# EAGLE schematic ManitoBoardv.5 (EAGLE 7.2.0)
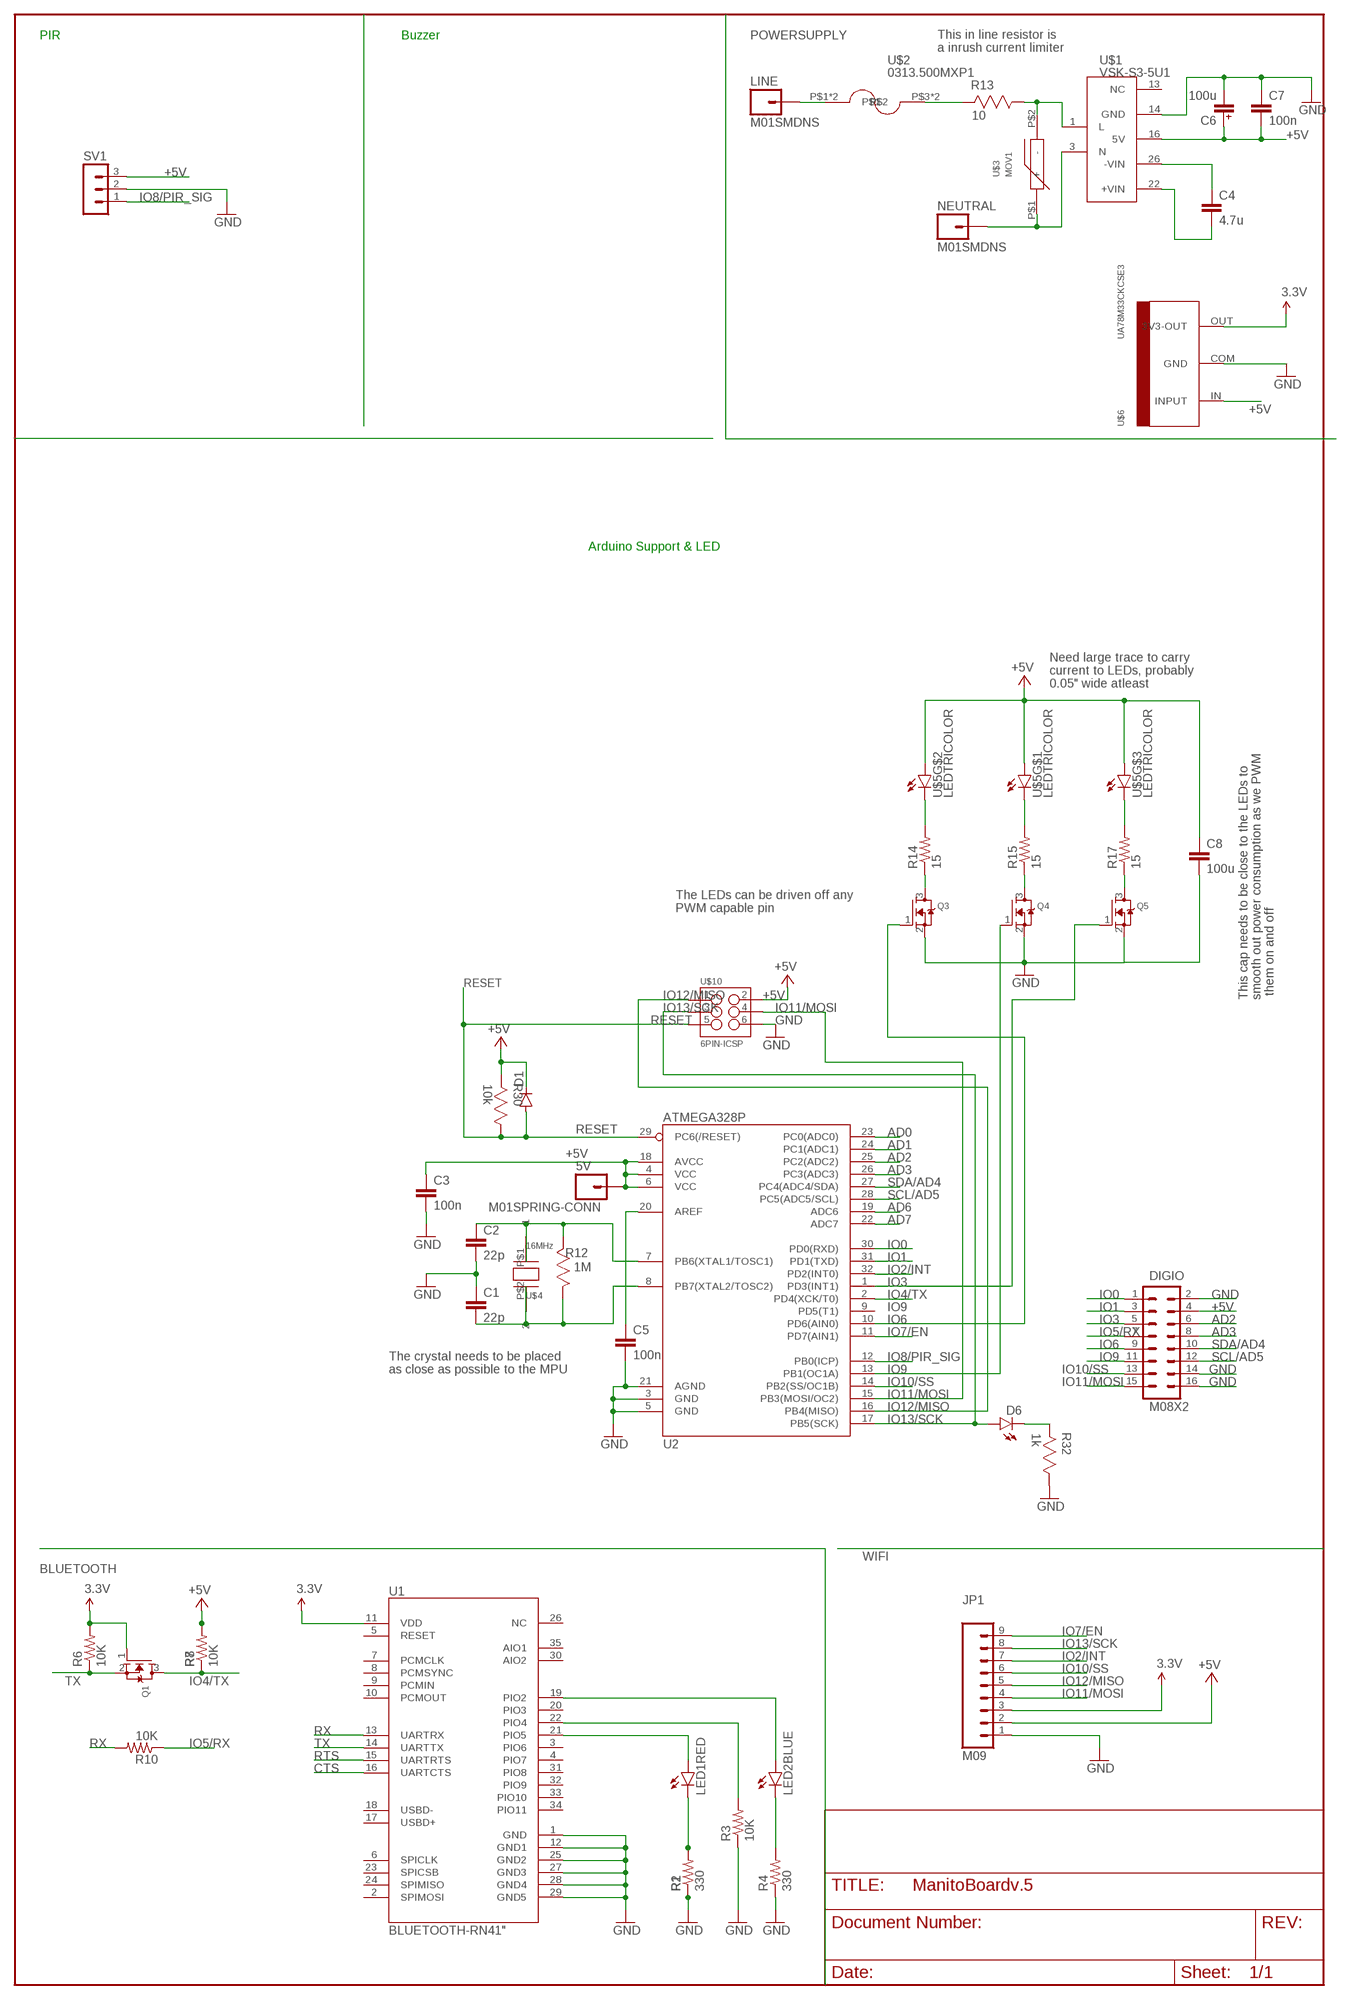
[diagram p0: schematic, sheet 1]

## Parts
5V  M01SPRING-CONN  [SPRING-CONNECTOR]
C1  22p  CAP0603-CAP  [0603-CAP]
C2  22p  CAP0603-CAP  [0603-CAP]
C3  100n  CAP0603-CAP  [0603-CAP]
C4  4.7u  CAP0603-CAP  [0603-CAP]
C5  100n  CAP0603-CAP  [0603-CAP]
C6  100u  SMDCAP1  [WXSERIES-SMDCAP]
C7  100n  CAP0603-CAP  [0603-CAP]
C8  100u  CAP0603-CAP  [0603-CAP]
D1  DIODE1N4148  [DIODE-1N4148]
D6  LED-YELLOW0603  [LED-0603]
DIGIO  M08X2  [2X8]
JP1  M09  [1X09]
LED1RED  LED3MM  [LED3MM]
LED2BLUE  LED3MM  [LED3MM]
LINE  M01SMDNS  [1X01NS]
NEUTRAL  M01SMDNS  [1X01NS]
Q1  MOSFET-NREFLOW  [SOT23]
Q3  MOSFET-NREFLOW  [SOT23]
Q4  MOSFET-NREFLOW  [SOT23]
Q5  MOSFET-NREFLOW  [SOT23]
R1  RESISTORPTH-1/4W  [AXIAL-0.4]
R2  330  RESISTORPTH-1/4W  [AXIAL-0.4]
R3  10K  RESISTORPTH-1/4W  [AXIAL-0.4]
R4  330  RESISTORPTH-1/4W  [AXIAL-0.4]
R6  10K  RESISTORPTH-1/2W  [AXIAL-0.5]
R7  RESISTORPTH-1/2W  [AXIAL-0.5]
R8  10K  RESISTORPTH-1/2W  [AXIAL-0.5]
R10  10K  RESISTORPTH-1/2W  [AXIAL-0.5]
R12  1M  0603RESISTOR1  [0603RESISTOR]
R13  10  0603RESISTOR1  [0603RESISTOR]
R14  15  RESISTORPTH-1W  [AXIAL-0.6]
R15  15  RESISTORPTH-1W  [AXIAL-0.6]
R17  15  RESISTORPTH-1W  [AXIAL-0.6]
R30  10k  0603RESISTOR1  [0603RESISTOR]
R32  1k  0603RESISTOR1  [0603RESISTOR]
SV1  MA03-1  [MA03-1]
U1  BLUETOOTH-RN41"  [RN41]
U2  ATMEGA328P  ATMEGA328_SMT  [TQFP32-08]
U$1  VSK-S3-5U1  [VSK-S3-DCAC]
U$2  0313.500MXP1  [FUSEHOLDER0.25IN]
U$3  MOV1  [MOV]
U$4  16MHz  SMDCRYSTAL  [SMDCRYSTAL]
U$5  LEDTRICOLOR  [TRICOLORLED]
U$6  UA78M33CKCSE3  [TO220]
U$10  6PIN-ICSP  [2X3-ICSP]

## Nets
+5V [usbvcc]: 5V.P$2 C3.1 C6.POS C7.2 C8.1 D1.C DIGIO.4 JP1.2 R7.P$2 R8.P$2 R30.2 SV1.3 U2.4(VCC) U2.6(VCC) U2.18(AVCC) U$1.16(5V) U$5.A1(A) U$5.A2(A) U$5.A3(A) U$6.IN(INPUT) U$10.2(+5V)
AD0: U2.23(PC0(ADC0))
AD1: U2.24(PC1(ADC1))
AD2: DIGIO.6 U2.25(PC2(ADC2))
AD3: DIGIO.8 U2.26(PC3(ADC3))
AD6: U2.19(ADC6)
AD7: U2.22(ADC7)
CTS: U1.16(UARTCTS)
GND: C1.1 C2.2 C3.2 C5.2 C6.NEG C7.1 C8.2 DIGIO.2 DIGIO.14 DIGIO.16 JP1.1 Q3.2(S) Q4.2(S) Q5.2(S) R1.P$1 R2.P$1 R3.P$1 R4.P$1 R32.1 SV1.2 U1.1(GND) U1.12(GND1) U1.25(GND2) U1.27(GND3) U1.28(GND4) U1.29(GND5) U2.3(GND) U2.5(GND) U2.21(AGND) U$1.14(GND) U$6.COM(GND) U$10.6(GND)
IO0: DIGIO.1 U2.30(PD0(RXD))
IO1: DIGIO.3 U2.31(PD1(TXD))
IO2/INT: JP1.7 U2.32(PD2(INT0))
IO3: DIGIO.5 Q5.1(G) U2.1(PD3(INT1))
IO4/TX: Q1.3(D) R7.P$1 R8.P$1 U2.2(PD4(XCK/T0))
IO5/RX: DIGIO.7 R10.P$1
IO6: DIGIO.9 Q3.1(G) U2.10(PD6(AIN0))
IO7/EN: JP1.9 U2.11(PD7(AIN1))
IO8/PIR_SIG: SV1.1 U2.12(PB0(ICP))
IO9: DIGIO.11 Q4.1(G) U2.13(PB1(OC1A))
IO10/SS: DIGIO.13 JP1.6 U2.14(PB2(SS/OC1B))
IO11/MOSI: DIGIO.15 JP1.4 U2.15(PB3(MOSI/OC2)) U$10.4(MOSI)
IO12/MISO: JP1.5 U2.16(PB4(MISO)) U$10.1(MISO)
IO13/SCK: D6.A JP1.8 U2.17(PB5(SCK)) U$10.3(SCK)
N$1: C1.2 R12.1 U2.8(PB7(XTAL2/TOSC2)) U$4.P$2
N$3: LED1RED.K(C) R1.P$2 R2.P$2
N$4: C2.1 R12.2 U2.7(PB6(XTAL1/TOSC1)) U$4.P$1
N$6: Q5.3(D) R17.P$1
N$7: Q4.3(D) R15.P$1
N$8: Q3.3(D) R14.P$1
N$17: C5.1 U2.20(AREF)
N$18: D6.C R32.2
N$19: C4.1 U$1.26(-VIN)
N$20: LED2BLUE.K(C) R4.P$2
N$21: C4.2 U$1.22(+VIN)
N$22: R13.1 U$1.1(L) U$3.P$2(-)
N$23: NEUTRAL.1 U$1.3(N) U$3.P$1(+)
N$24: LINE.1 U$2.P$1 U$2.P$2
N$25: R13.2 U$2.P$3 U$2.P$4
N$29: R14.P$2 U$5.C2(C)
N$30: R15.P$2 U$5.C1(C)
N$31: R17.P$2 U$5.C3(C)
N$32: LED1RED.A U1.21(PIO5)
N$33: R3.P$2 U1.22(PIO4)
N$34: LED2BLUE.A U1.19(PIO2)
RESET: D1.A R30.1 U2.29(PC6(/RESET)) U$10.5(RESET)
RTS: U1.15(UARTRTS)
RX: R10.P$2 U1.13(UARTRX)
SCL/AD5: DIGIO.12 U2.28(PC5(ADC5/SCL))
SDA/AD4: DIGIO.10 U2.27(PC4(ADC4/SDA))
TX: Q1.2(S) R6.P$1 U1.14(UARTTX)
VCC: JP1.3 Q1.1(G) R6.P$2 U1.11(VDD) U$6.OUT(3V3-OUT) ; supply symbol labelled 3.3V
Unconnected: U1.2(SPIMOSI) U1.3(PIO6) U1.4(PIO7) U1.5(RESET) U1.6(SPICLK) U1.7(PCMCLK) U1.8(PCMSYNC) U1.9(PCMIN) U1.10(PCMOUT) U1.17(USBD+) U1.18(USBD-) U1.20(PIO3) U1.23(SPICSB) U1.24(SPIMISO) U1.26(NC) U1.30(AIO2) U1.31(PIO8) U1.32(PIO9) U1.33(PIO10) U1.34(PIO11) U1.35(AIO1) U2.9(PD5(T1)) U$1.13(NC)

## Notes on the sheet
- PIR | Buzzer
- This in line resistor is 
  a inrush current limiter
- Arduino Support & LED
- Need large trace to carry
  current to LEDs, probably
  0.05" wide atleast
- The LEDs can be driven off any
  PWM capable pin
- This cap needs to be close to the LEDs to 
  smooth out power consumption as we PWM
   them on and off
- The crystal needs to be placed
  as close as possible to the MPU

## Library data of the parts
5V LINE NEUTRAL = CharlieCreations:M01: Header 1 Standard 1-pin 0.1" header. Use with straight break away headers (SKU : PRT-00116), right angle break away headers (PRT-00553), swiss pins (PRT-00743), machine pins (PRT-00117), and female headers (PRT-00115).
C1-C5 C7 C8 = CharlieCreations:CAP: Capacitor Standard 0603 ceramic capacitor, and 0.1" leaded capacitor.
C6 = CharlieCreations:SMDCAP
D1 = CharlieCreations:DIODE: Diode These are standard reverse protection diodes and small signal diodes. SMA package can handle up to about 1A. SOD-323 can handle about 200mA. What the SOD-323 package when ordering, there are some mfgs out there that are 5-pin packages.
D6 = CharlieCreations:LED-YELLOW: Yellow SMD LEDs LilyPad 1206- DIO-09909 0603- DIO-09003; PROD_ID: DIO-09003
DIGIO = CharlieCreations:M08X2: .1" headers, two rows of 8 each
JP1 = SparkFun-Connectors:M09: Header 9 Standard 9-pin 0.1" header. Use with straight break away headers (SKU : PRT-00116), right angle break away headers (PRT-00553), swiss pins (PRT-00743), machine pins (PRT-00117), and female headers (PRT-00115).
LED1RED LED2BLUE = SparkFun-LED:LED: LEDs Standard schematic elements and footprints for 5mm, 3mm, 1206, and 0603 sized LEDs. 5mm - Spark Fun Electronics SKU : COM-00529 (and others)
Q1 = adafruit:MOSFET-N: N-Channel Mosfet 2N7002E - 60V 260mA SOT23 [Digikey: 2N7002ET1GOSTR-ND] - REEL BSH103 - 30V 850mA SOT23 [Digikey: 568-5013-1-ND]
Q3-Q5 = CharlieCreations:MOSFET-N: N-Channel Mosfet 2N7002E - 60V 260mA SOT23 [Digikey: 2N7002ET1GOSTR-ND] - REEL BSH103 - 30V 850mA SOT23 [Digikey: 568-5013-1-ND]
R1-R4 R6-R8 R10 R14 R15 R17 = SparkFun-Passives:RESISTOR: Resistor Basic schematic elements and footprints for 0603, 1206, and PTH resistors.
R12 R13 R30 R32 = CharlieCreations:0603RESISTOR: RESISTOR, 0603; MPN: CRCW06031K21FKEA; OC_FARNELL: 1652852; OC_NEWARK: 52K8027; SUPPLIER: Vishay; TOLERANCE: ± 1.0 %; VALUE: 0; WATTAGE: 0.1W
SV1 = con-lstb:MA03-1: PIN HEADER; OC_FARNELL: unknown; OC_NEWARK: unknown
U1 = SparkFun:BLUETOOTH-RN41
U2 = CharlieCreations:ATMEGA328_SMT: 32-Pin Atmega328 part Commonly used on Arduino compatible boards Available in QFP and QFN packages TQFP is IC-09069 QFN is non-stock; PROD_ID: IC-09069
U$1 = CharlieCreations:VSK-S3-5U: Universal AC to DC adapter, 5V Output, Manufacturer: CUI Inc
U$2 = CharlieCreations:0313.500MXP: 500mA Fuse by LittleFuse INC
U$3 = CharlieCreations:MOV
U$4 = CharlieCreations:SMDCRYSTAL
U$5 = CharlieCreations:LEDTRICOLOR
U$6 = CharlieCreations:UA78M33CKCSE3: 3.3V, 500mA Linear Regulator, By: TI
U$10 = CharlieCreations:6PIN-ICSP

## Net classes
2 gnd: width 0.305 mm, drill 0.559 mm, clearance 0.254 mm
3 usbvcc: width 0.508 mm, drill 0.61 mm, clearance 0.254 mm